# Altium schematic sheet CaRe_Schematic_SMD_FRONT_PANEL.SchDoc
size B
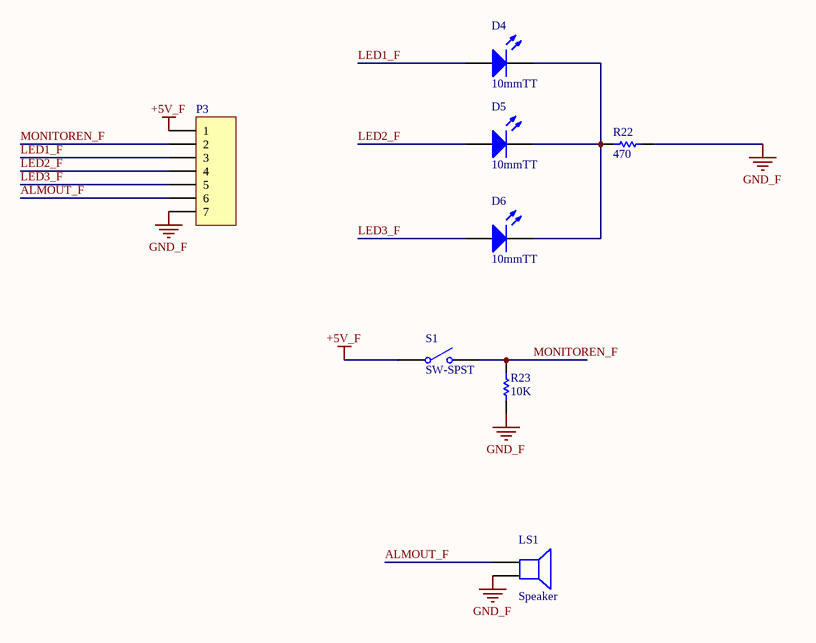
[diagram p0: CaRe_Schematic_SMD_FRONT_PANEL.SchDoc]

## Parts
D4  10mmTT  [10mmLED]
D5  10mmTT  [10mmLED]
D6  10mmTT  [10mmLED]
LS1  Speaker  [HDR1X2]
P3  Header 7  [HDR1X7]  (value not drawn)
R22  value 470  [RES0805]  (hidden comment: Resistor)
R23  value 10K  [RES0805]  (hidden comment: Resistor)
S1  SW-SPST  [SPST]

## Nets
+5V_F: P3.1 S1.1(COMMON)
GND_F: LS1.2 P3.7 R22.2 R23.1
ALMOUT_F: LS1.1 P3.6
LED1_F: D4.1(A) P3.3
LED2_F: D5.1(A) P3.4
LED3_F: D6.1(A) P3.5
MONITOREN_F: P3.2 R23.2 S1.2(NO)
NetD4_2: D4.2(K) D5.2(K) D6.2(K) R22.1

## Library data of the parts
D4-D6 = 10mmLED: Typical RED LED; Part Number: P_100_LTST-C170KRKT; Published: 8-Jun-2000; LatestRevisionDate: 08-Jul-2005; LatestRevisionNote: Mech Layer 1 removed.; PackageReference: LED-1; Publisher: Altium Limited; PackageDescription: LED; 2 Leads
LS1 = Speaker: Loudspeaker; Published: 24-Mar-1999; LatestRevisionDate: 17-Jul-2002; LatestRevisionNote: Re-released for DXP Platform.; PackageReference: PIN2; Publisher: Altium Limited
P3 = Header 7: Header, 7-Pin; LatestRevisionDate: 17-Jul-2002; LatestRevisionNote: Re-released for DXP Platform.; Publisher: Altium Limited
R22 R23 = Chip Res: Published: 8-Jun-2000; LatestRevisionDate: 17-Jul-2002; LatestRevisionNote: Re-released for DXP Platform.; PackageReference: AXIAL-0.3; Publisher: Altium Limited; PackageDescription: Axial Device, Thru-Hole; 2 Leads; 0.3 in Pin Spacing
S1 = SW-SPST: Single-Pole, Single-Throw Switch; Published: 24-Mar-1999; LatestRevisionDate: 17-Jul-2002; LatestRevisionNote: Re-released for DXP Platform.; PackageReference: SPST-2; Publisher: Altium Limited; PackageDescription: Switch; 2 Leads